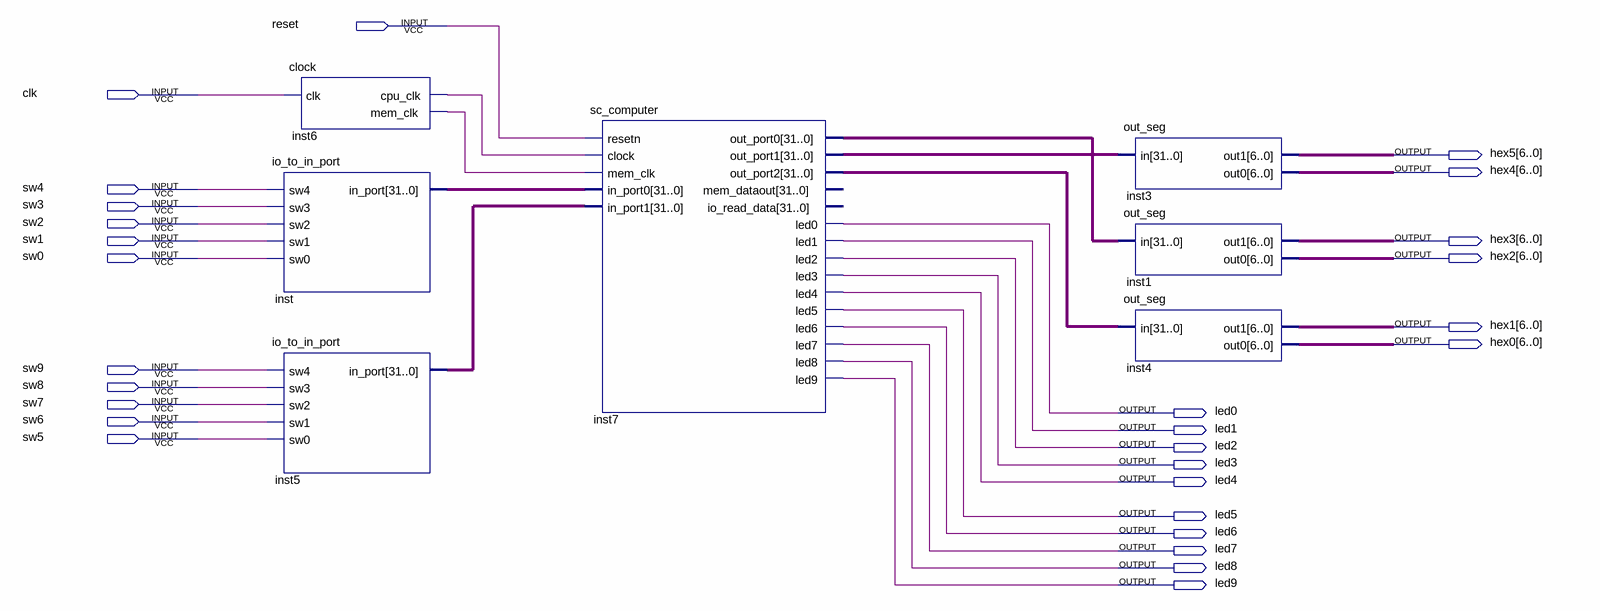
[diagram p0: schematic sheet]
// Quartus schematic sc_computer_bdf.bdf as structural Verilog: 7 symbols, 28 pins
module sc_computer_bdf (
  input  reset,
  input  clk,
  input  sw4,
  input  sw3,
  input  sw2,
  input  sw1,
  input  sw0,
  input  sw9,
  input  sw8,
  input  sw7,
  input  sw6,
  input  sw5,
  output [6:0] hex5,
  output [6:0] hex4,
  output [6:0] hex3,
  output [6:0] hex2,
  output [6:0] hex1,
  output [6:0] hex0,
  output led0,
  output led1,
  output led2,
  output led3,
  output led4,
  output led5,
  output led6,
  output led7,
  output led8,
  output led9
);

  wire inst6_cpu_clk, inst6_mem_clk;
  wire [31:0] inst5_in_port, inst7_out_port0, inst7_out_port1, inst7_out_port2, inst_in_port;

  clock inst6 (.clk(clk), .cpu_clk(inst6_cpu_clk), .mem_clk(inst6_mem_clk));
  io_to_in_port inst (.sw4(sw4), .sw3(sw3), .sw2(sw2), .sw1(sw1), .sw0(sw0), .in_port(inst_in_port));
  io_to_in_port inst5 (.sw4(sw9), .sw3(sw8), .sw2(sw7), .sw1(sw6), .sw0(sw5), .in_port(inst5_in_port));
  sc_computer inst7 (
    .resetn(reset), .clock(inst6_cpu_clk), .mem_clk(inst6_mem_clk), .in_port0(inst_in_port),
    .in_port1(inst5_in_port), .out_port0(inst7_out_port0), .out_port1(inst7_out_port1),
    .out_port2(inst7_out_port2), .led0(led0), .led1(led1), .led2(led2), .led3(led3), .led4(led4),
    .led5(led5), .led6(led6), .led7(led7), .led8(led8), .led9(led9));  // open: mem_dataout, io_read_data
  out_seg inst3 (.in(inst7_out_port1), .out1(hex5), .out0(hex4));
  out_seg inst1 (.in(inst7_out_port0), .out1(hex3), .out0(hex2));
  out_seg inst4 (.in(inst7_out_port2), .out1(hex1), .out0(hex0));
endmodule
